# EAGLE schematic LDO (EAGLE 9.6.2)
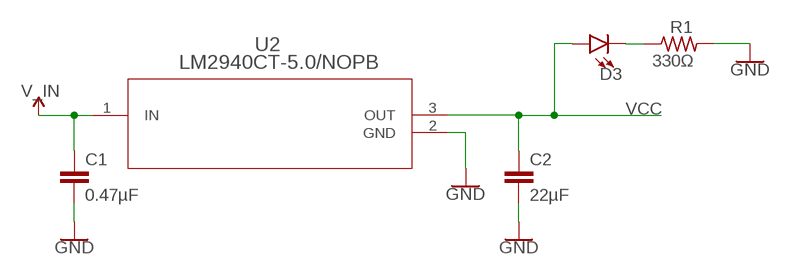
[diagram p0: schematic, sheet 1]

## Parts
C1  0.47µF  470PF-0603-50V-5%  [0603]
C2  22µF  22PF-PTH-2.54MM-200V-5%  [CAP-PTH-2.54]
D3  LED5MM  [LED_5MM]
R1  330Ω  R-US_0207/2V  [0207/2V]
U2  LM2940CT-5.0/NOPB  [T03B]

## Nets
GND: C1.2 C2.2 R1.2 U2.2(GND)
N$6: D3.K(C) R1.1
V_IN: C1.1 U2.1(IN) ; supply symbol labelled VCC
VCC: C2.1 D3.A U2.3(OUT)

## Library data of the parts
C1 = SparkFun-Capacitors:470PF: 470pF ceramic capacitors A capacitor is a passive two-terminal electrical component used to store electrical energy temporarily in an electric field.; PROD_ID: CAP-07884; SPICEPREFIX: C; VALUE: 470pF
C2 = SparkFun-Capacitors:22PF: 22pF ceramic capacitors A capacitor is a passive two-terminal electrical component used to store electrical energy temporarily in an electric field.; PROD_ID: CAP-09128; SPICEPREFIX: C; VALUE: 22pF
D3 = SparkFun-LED:LED: LED (Generic) Standard schematic elements and footprints for 5mm, 3mm, 1206, and 0603 sized LEDs. Generic LEDs with no color specified.
R1 = rcl:R-US_: RESISTOR, American symbol; SPICEPREFIX: R
U2 = Voltage_regulator_footprints:LM2940CT-5.0/NOPB; COPYRIGHT: Copyright (C) 2023 Ultra Librarian. All rights reserved.; MANUFACTURER_PART_NUMBER: LM2940CT-5.0/NOPB; MFR_NAME: Texas Instruments; SPICEPREFIX: U; TYPE: LM2940CT-12

## Module TEST
Ports: V_OUT(io)

### Library data of the parts